# EAGLE design tps61040 (EAGLE 9.6.2)
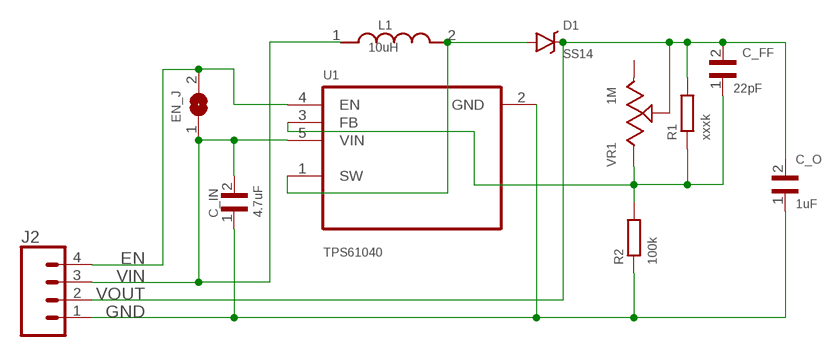
[diagram p0: schematic, sheet 1]

## Parts
C_FF  22pF  WCAP-CSGP_0603-REFLOW  [WCAP-CSGP_0603_REFLOW]
C_IN  4.7uF  WCAP-CSGP_0603-REFLOW  [WCAP-CSGP_0603_REFLOW]
C_O  1uF  WCAP-CSGP_0603-REFLOW  [WCAP-CSGP_0603_REFLOW]
D1  SS14  SS54  [DO-214AC]
EN_J  SJ  [SJ]
J2  CONN_041X04_NO_SILK  [1X04_NO_SILK]
L1  10uH  CD43  [CD43]
R1  xxxk  R-EU_R0603  [R0603]
R2  100k  R-EU_R0603  [R0603]
U1  TPS61040  TPS61040DBVR  [SOT95P280X145-5N]
VR1  1M  TC33X-2-103G  [TRIMMER_TC33X-2-103G]

## Nets
EN: EN_J.2 J2.4 U1.4(EN)
GND: C_IN.1 C_O.1 J2.1 R2.1 U1.2(GND)
N$1: D1.A L1.2 U1.1(SW)
N$2: C_FF.1 R1.1 R2.2 U1.3(FB) VR1.1(CCW)
VIN: C_IN.2 EN_J.1 J2.3 L1.1 U1.5(VIN)
VOUT: C_FF.2 C_O.2 D1.C J2.2 R1.2 VR1.2(WIPER)
Unconnected: VR1.3(CW)

## Library data of the parts
C_FF C_IN C_O = Passive_Capacitors_rev15a:WCAP-CSGP: WCAP-CSGP Ceramic Capacitors Characteristics Multilayer Ceramic Chip Capacitor Recommended soldering:Reflow, for 0603 and 0805 wave soldering is also allowed Operating temperature:-55 °C to +125 °C; Ceramic characteristics: Class I - NPO ; Class II -X7R, X5R High performance ceramic High capacitance stability Minimal aging Termination:Cu/Ni/Sn <http://katalog.we-online.de/media/images/eisos/WCAP-CSGP_pf2.jpg> Details see: http://katalog.we-online.de/en/pbs/WCAP-CSGP/?m Created: 2015-01-28 2015 (C) Wurth Elektronik
D1 = SS54:SS54: SCHOTTKY DIODES 40Vpeak, 28Vrms 5A (SBD) SMA(DO-214AC) Check availability <https://pricing.snapeda.com/parts/SS54/MDD/view-part?ref=eda>; AVAILABILITY: In Stock; CHECK_PRICES: https://www.snapeda.com/parts/SS54/MDD/view-part/?ref=eda; DESCRIPTION: Diode Schottky 40 V 5A Surface Mount SMA; MF: MDD; MP: SS54; PACKAGE: None; PRICE: None; PURCHASE-URL: https://www.snapeda.com/api/url_track_click_mouser/?unipart_id=12137997&manufacturer=MDD&part_name=SS54&search_term=None; SNAPEDA_LINK: https://www.snapeda.com/parts/SS54/MDD/view-part/?ref=snap
EN_J = jumper:SJ: SMD solder JUMPER
J2 = SparkFun-Connectors:CONN_04: Multi connection point. Often used as Generic Header-pin footprint for 0.1 inch spaced/style header connections On any of the 0.1 inch spaced packages, you can populate with these: Break Away Headers - Straight <https://www.sparkfun.com/products/116> (PRT-00116) Break Away Male Headers - Right Angle <https://www.sparkfun.com/products/553> (PRT-00553) Female Headers <https://www.sparkfun.com/products/115> (PRT-00115) Break Away Headers - Machine Pin <https://www.sparkfun.com/products/117> (PRT-00117) Break Away Female Headers - Swiss Machine Pin <https://www.sparkfun.com/products/743> (PRT-00743) For SCREWTERMINALS and SPRING TERMINALS visit here: Screw Terimnals on SparkFun.com <https://www.sparkfun.com/search/results?term=Screw+Terminals> (5mm/3.5mm/2.54mm spacing) This device is also useful as a general connection point to wire up your design to another part of your project. Our various solder wires solder well into these plated through hole pads. Hook-Up Wire - Assortment (Stranded, 22 AWG) <https://www.sparkfun.com/products/11375> (PRT-11375) Hook-Up Wire - Assortment (Solid Core, 22 AWG) <https://www.sparkfun.com/products/11367> (PRT-11367) View the entire wire category on our website here <https://www.sparkfun.com/categories/141> Special notes: Molex polarized connector foot print use with SKU : PRT-08231 with associated crimp pins and housings. 1MM SMD Version SKU: PRT-10208; PROD_ID: CONN-09696
L1 = cd43:CD43: Generic CD43 inductor library to get cheap aliexpress inductors on any board. Dimensions derived from https://eu.mouser.com/datasheet/2/390/CD43-523460.pdf
R1 R2 = rcl:R-EU_: RESISTOR, European symbol; SPICEPREFIX: R
U1 = TPS61040DBVR:TPS61040DBVR: Check availability <https://pricing.snapeda.com/parts/TPS61040DBVR/Texas%20Instruments/view-part?ref=eda>; AVAILABILITY: In Stock; CHECK_PRICES: https://www.snapeda.com/parts/TPS61040DBVR/Texas+Instruments/view-part/?ref=eda; DESCRIPTION: 28-V, 400-mA Switch Boost Converter in SOT-23 for LCD and White LED Applications; MF: Texas Instruments; MP: TPS61040DBVR; PACKAGE: SOT-23-5 Texas Instruments; PRICE: None; PURCHASE-URL: https://www.snapeda.com/api/url_track_click_mouser/?unipart_id=218715&manufacturer=Texas Instruments&part_name=TPS61040DBVR&search_term=tps61040; SNAPEDA_LINK: https://www.snapeda.com/parts/TPS61040DBVR/Texas+Instruments/view-part/?ref=snap
VR1 = TC33X-2-103G:TC33X-2-103G: Res Trimmer 10K Ohm 25% 1/10W 1(Elec)/1(Mech)Turn (3 X 3.8mm) Foot Print SMD Embossed T/R Check availability <https://pricing.snapeda.com/parts/TC33X-2-103G/Bourns/view-part?ref=eda>; AVAILABILITY: In Stock; CHECK_PRICES: https://www.snapeda.com/parts/TC33X-2-103G/Bourns/view-part/?ref=eda; DESCRIPTION: 10 kOhms 0.1W, 1/10W J Lead Surface Mount Trimmer Potentiometer Cermet 1.0 Turn Top Adjustment; MF: Bourns; MP: TC33X-2-103G; PACKAGE: SOD-23 Bourns; PRICE: None; PURCHASE-URL: https://www.snapeda.com/api/url_track_click_mouser/?unipart_id=1475438&manufacturer=Bourns&part_name=TC33X-2-103G&search_term=potentiometer smd; SNAPEDA_LINK: https://www.snapeda.com/parts/TC33X-2-103G/Bourns/view-part/?ref=snap

## Board
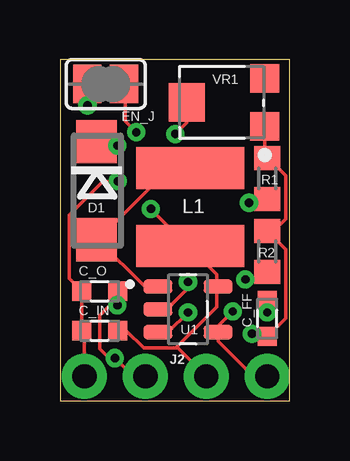
[diagram p1: board, top side]
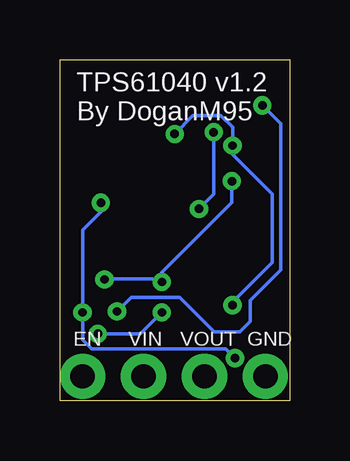
[diagram p2: board, bottom side, seen from below]

Size 9.58 x 14.21 mm. Coordinates in mm from the lower left corner, seen from the top.
Outline: 0,0 9.58,0 9.58,14.21 0,14.21 0,0
Copper layers (1*16): Top 0.035mm / dielectric 1.5mm / Bottom 0.035mm
Design rules "default *": minimum track width 6mil, minimum drill 0.35mm, track to track 6mil, track to pad 6mil, pad to pad 6mil, via to via 6mil, smd to smd 6mil, copper to edge 40mil, drill to drill 6mil, minimum pad ring 10mil, minimum via ring 8mil, stop-mask expansion 4mil, vias tented up to drill 20mil, thermal gap 10mil

### Footprints (pad centres in the part's own frame; a part is rotated, then mirrored left to right if it is on the bottom)
WCAP-CSGP_0603_REFLOW = smd 0.8 x 0.8: 1 -0.75,0; 2 0.75,0
DO-214AC = smd 1.8 x 1.7: A 2.05,0; C -2.05,0
SJ = smd 1.168 x 1.6: 1 -0.762,0; 2 0.762,0
1X04_NO_SILK = drill 1.016 pad 1.88: 1 0,0; 2 2.54,0; 3 5.08,0; 4 7.62,0
CD43 = smd 4.5 x 1.75: 1 2.25,0.875; 2 2.25,4.125
R0603 = smd 1 x 1.1: 1 -0.85,0; 2 0.85,0
SOT95P280X145-5N = smd 1.21 x 0.59: 1 -1.255,0.95; 2 -1.255,0; 3 -1.255,-0.95; 4 1.255,-0.95; 5 1.255,0.95
TRIMMER_TC33X-2-103G = smd 1.2 x 1.2: 1 -1,-1.8; 3 1,-1.8 | smd 1.6 x 1.5: 2 0,1.45

### Placement (x,y rotation side)
C_FF  8.64,3.43 90 top
C_IN  1.65,2.92 0 top
C_O  1.65,4.57 0 top
D1  1.52,8.76 270 top
EN_J  1.91,13.21 180 top
J2  1.02,1.02 0 top
L1  3.17,5.59 0 top
R1  8.64,9.27 270 top
R2  8.64,6.22 90 top
U1  5.33,3.81 0 top
VR1  6.73,12.45 90 top

### Tracks (layer width: path | path; a pad name or v marks a point on that pad's centre or on a via)
EN  (via drill 0.35)
  Top 0.152: EN_J.2 v1.14,12.32 | v7.2,3.72 6.59,3.12 U1.4 6.59,2.48 8.05,1.02 J2.4
  Bottom 0.152: v1.14,12.32 0.38,11.56 0.38,5.46 1.65,4.19 1.65,3.3 2.08,2.87 3.15,2.87 4.59,4.32 6.6,4.32 v7.2,3.72
GND  (via drill 0.35)
  Top 0.152: v2.41,9.16 2.41,9.14 1.78,9.14 0.38,7.75 0.38,5.09 C_O.1 C_IN.1 1.02,2.81 J2.1 | v5.33,4.95 5.33,4.7 4.45,3.81 U1.2 | R2.1 8.32,5.06 v7.72,5.06
  Bottom 0.152: v2.41,9.16 2.41,8.27 5.33,5.35 v5.33,4.95 5.46,5.08 7.7,5.08 v7.72,5.06
N$1
  Top 0.152: U1.1 3.94,4.8 3.48,4.8 1.65,6.63 D1.A 1.65,6.78 4.55,9.68 5.31,9.68 L1.2
N$2  (via drill 0.35)
  Top 0.152: v5.33,3.68 4.51,2.86 U1.3 | v8,2.79 8.52,2.79 C_FF.1 9.4,3.44 9.4,6.31 R2.2 8.89,7.07 9.4,7.58 9.4,9.4 8.68,10.12 R1.1 8.53,10.23 VR1.1
  Bottom 0.152: v5.33,3.68 6.22,2.79 v8,2.79
VIN  (via drill 0.35)
  Top 0.152: C_IN.2 2.77,2.92 3.48,2.21 4.83,2.21 | v3.17,11.2 2.72,11.66 2.72,13.18 EN_J.1 | v3.79,8 5.31,6.48 L1.1 5.46,6.33 6.53,5.26 6.53,4.8 U1.5 6.53,4.65 6.53,3.91 4.83,2.21 | J2.3 4.9,2.21 4.83,2.21
  Bottom 0.152: v3.17,11.2 3.17,8.61 v3.79,8
VOUT  (via drill 0.35)
  Top 0.152: v2.39,10.64 1.75,10.64 1.65,10.74 D1.C | C_O.2 2.39,4.57 v2.39,3.99 2.09,3.99 1.65,3.55 1.65,2.16 2.03,1.78 v2.29,1.78 3.05,1.02 J2.2 | VR1.2 5.28,11.61 v4.8,11.12 | C_FF.2 v8.64,3.68 | R1.2 8.47,8.26 v7.87,8.26
  Bottom 0.152: v2.39,3.99 2.39,4.12 0.74,5.77 0.74,8.61 2.39,10.26 v2.39,10.64 2.39,11.4 2.87,11.89 4.04,11.89 v4.8,11.12 | v2.29,1.78 2.67,2.16 8.26,2.16 8.64,2.54 v8.64,3.68 8.64,7.11 7.87,7.87 v7.87,8.26

### Text on the board
bNames: TPS61040 v1.2 / By DoganM95 | GND | VOUT | VIN | EN